# Altium project Panorama_V_0_0_1.PrjPcb
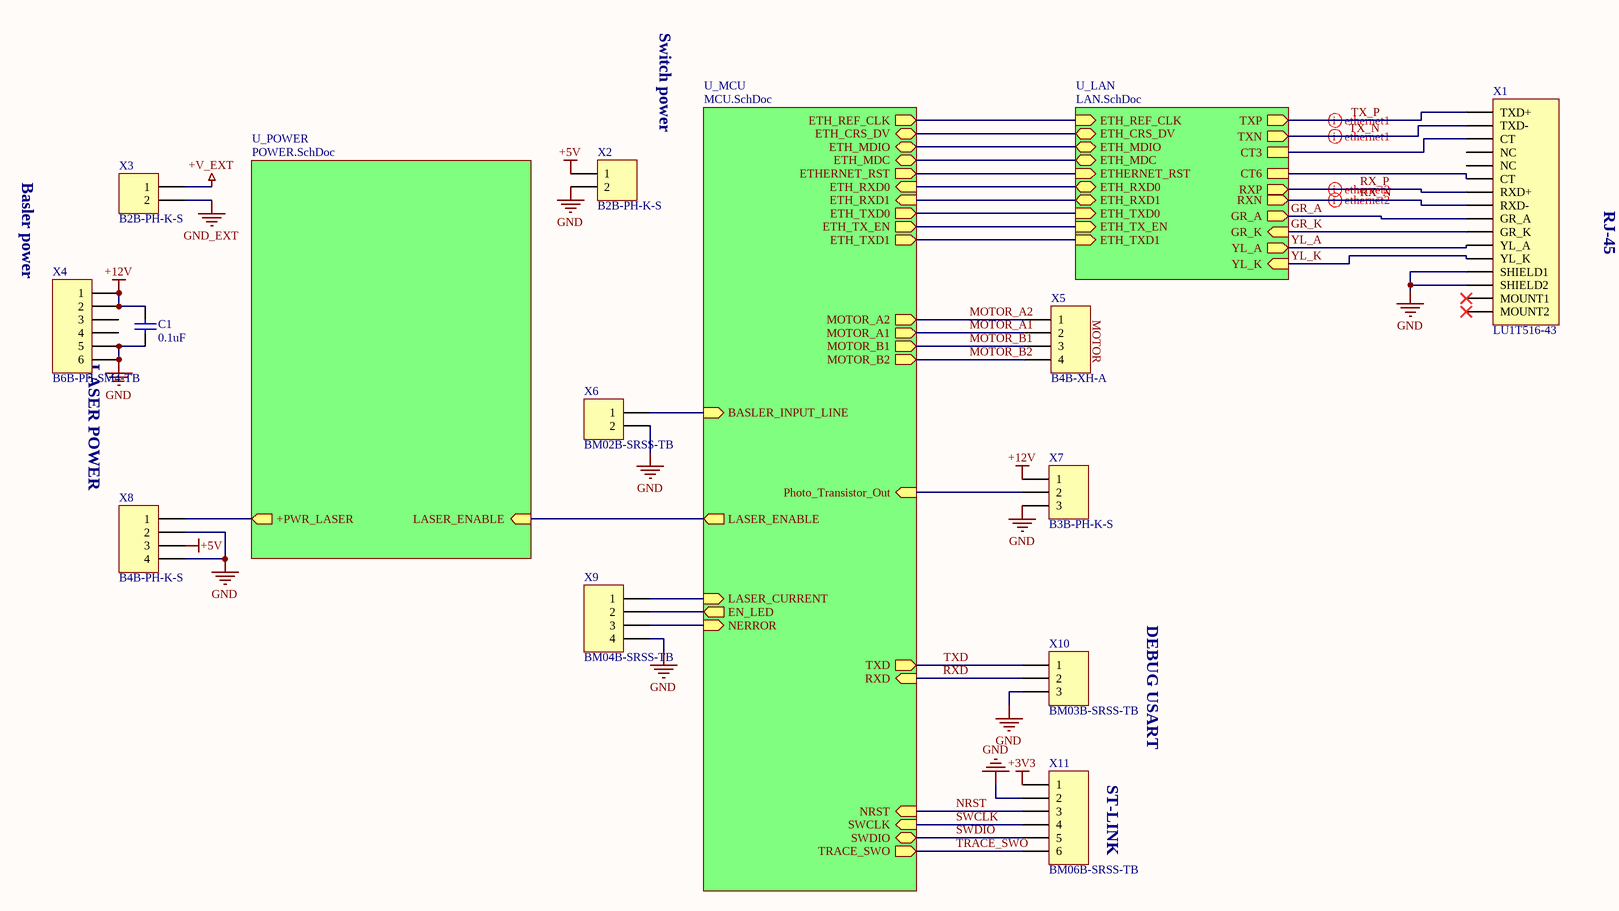
[diagram p0: Panorama_V_0_0_1.SchDoc]
4 sheets, 113 parts. Net scope: hierarchical (ports join the sheet entries above them; power ports are global).
Board file: Panorama_V_0_0_1.PcbDoc
Sheets:
  Panorama_V_0_0_1.SchDoc
    U_POWER = POWER.SchDoc
    U_MCU = MCU.SchDoc
    U_LAN = LAN.SchDoc

## Sheet Panorama_V_0_0_1.SchDoc
size A3

### Parts
C1  value 0.1uF  [C0603]  (hidden comment: C0603-0.1uF-50V-X7R)
X1  LU1T516-43  [LU1T516-43]
X2  B2B-PH-K-S  [B2B-PH-K-S]
X3  B2B-PH-K-S  [B2B-PH-K-S]
X4  B6B-PH-SM4-TB  [B6B-PH-SM4-TB]
X5  B4B-XH-A  [B4B-XH-A]
X6  BM02B-SRSS-TB  [BM02B-SRSS-TB]
X7  B3B-PH-K-S  [B3B-PH-K-S]
X8  B4B-PH-K-S  [B4B-PH-K-S]
X9  BM04B-SRSS-TB  [BM04B-SRSS-TB]
X10  BM03B-SRSS-TB  [BM03B-SRSS-TB]
X11  BM06B-SRSS-TB  [BM06B-SRSS-TB]

### Sub-sheets
U_LAN = LAN.SchDoc: ETH_REF_CLK (in), ETH_CRS_DV (bidir), ETH_MDIO (bidir), ETH_MDC (bidir), ETHERNET_RST (in), ETH_RXD0 (bidir), ETH_RXD1 (bidir), ETH_TXD0 (in), ETH_TX_EN (in), ETH_TXD1 (in), TXP (out), TXN (out), RXP (out), RXN (out), GR_A (out), GR_K (in), YL_A (out), YL_K (in), CT3, CT6
U_MCU = MCU.SchDoc: MOTOR_A2 (out), MOTOR_A1 (out), MOTOR_B1 (out), MOTOR_B2 (out), ETH_REF_CLK (out), ETH_CRS_DV (bidir), ETH_MDIO (bidir), ETH_MDC (bidir), ETHERNET_RST (out), ETH_RXD0 (in), ETH_RXD1 (in), ETH_TXD0 (out), ETH_TX_EN (out), ETH_TXD1 (out), TXD (out), RXD (in), SWCLK (in), TRACE_SWO (out), LASER_ENABLE (out), BASLER_INPUT_LINE (in), LASER_CURRENT (in), EN_LED (out), NERROR (in), SWDIO (bidir), NRST (in), Photo_Transistor_Out (in)
U_POWER = POWER.SchDoc: LASER_ENABLE (in), +PWR_LASER (out)

### Nets
+3V3: X11.1
+3V3_LAN: X1.3(CT) X1.6(CT) ; sheet U_LAN/CT3, sheet U_LAN/CT6
+5V: X2.1 X8.3
+12V: C1.2 X4.1 X4.2 X7.1
+V_EXT: X3.1
GND: C1.1 X1.13(SHIELD1) X1.14(SHIELD2) X2.2 X4.5 X4.6 X6.2 X7.3 X8.2 X8.4 X9.4 X10.3 X11.2
GND_EXT: X3.2
+PWR_LASER: X8.1 ; sheet U_POWER/+PWR_LASER
BASLER_INPUT_LINE: X6.1 ; sheet U_MCU/BASLER_INPUT_LINE
EN_LED: X9.2 ; sheet U_MCU/EN_LED
ETH_CRS_DV: sheet U_MCU/ETH_CRS_DV, sheet U_LAN/ETH_CRS_DV
ETH_MDC: sheet U_MCU/ETH_MDC, sheet U_LAN/ETH_MDC
ETH_MDIO: sheet U_MCU/ETH_MDIO, sheet U_LAN/ETH_MDIO
ETH_REF_CLK: sheet U_MCU/ETH_REF_CLK, sheet U_LAN/ETH_REF_CLK
ETH_RXD0: sheet U_MCU/ETH_RXD0, sheet U_LAN/ETH_RXD0
ETH_RXD1: sheet U_MCU/ETH_RXD1, sheet U_LAN/ETH_RXD1
ETH_TX_EN: sheet U_MCU/ETH_TX_EN, sheet U_LAN/ETH_TX_EN
ETH_TXD0: sheet U_MCU/ETH_TXD0, sheet U_LAN/ETH_TXD0
ETH_TXD1: sheet U_MCU/ETH_TXD1, sheet U_LAN/ETH_TXD1
ETHERNET_RST: sheet U_MCU/ETHERNET_RST, sheet U_LAN/ETHERNET_RST
GR_A: X1.9(GR_A) ; sheet U_LAN/GR_A
GR_K: X1.10(GR_K) ; sheet U_LAN/GR_K
LASER_CURRENT: X9.1 ; sheet U_MCU/LASER_CURRENT
LASER_ENABLE: sheet U_POWER/LASER_ENABLE, sheet U_MCU/LASER_ENABLE
MOTOR_A1: X5.2 ; sheet U_MCU/MOTOR_A1
MOTOR_A2: X5.1 ; sheet U_MCU/MOTOR_A2
MOTOR_B1: X5.3 ; sheet U_MCU/MOTOR_B1
MOTOR_B2: X5.4 ; sheet U_MCU/MOTOR_B2
NERROR: X9.3 ; sheet U_MCU/NERROR
NRST: X11.3 ; sheet U_MCU/NRST
Photo_Transistor_Out: X7.2 ; sheet U_MCU/Photo_Transistor_Out
RX_N: X1.8(RXD-) ; sheet U_LAN/RXN
RX_P: X1.7(RXD+) ; sheet U_LAN/RXP
RXD: X10.2 ; sheet U_MCU/RXD
SWCLK: X11.4 ; sheet U_MCU/SWCLK
SWDIO: X11.5 ; sheet U_MCU/SWDIO
TRACE_SWO: X11.6 ; sheet U_MCU/TRACE_SWO
TX_N: X1.2(TXD-) ; sheet U_LAN/TXN
TX_P: X1.1(TXD+) ; sheet U_LAN/TXP
TXD: X10.1 ; sheet U_MCU/TXD
YL_A: X1.11(YL_A) ; sheet U_LAN/YL_A
YL_K: X1.12(YL_K) ; sheet U_LAN/YL_K

Not connected (* = marked no-connect by the designer): X1 4(NC) 5(NC) 15(MOUNT1)* 16(MOUNT2)*; X4 3 4 7(DNC) 8(DNC); X6 3(DNC) 4(DNC); X9 5 6; X10 4(DNC) 5(DNC); X11 7(DNC) 8(DNC)

### Layout directives
differential pair: RX_N, RX_P, TX_N, TX_P

### Notes on the sheet
- Switch power
- RJ-45
- (near X4) Basler power
- (near X5) MOTOR
- (near X8) LASER POWER
- DEBUG USART
- (near X11) ST-LINK

### Library data of the parts
C1 = C0603-0.1uF-50V-X7R: Ceramic Capacitor; Supplier 1: Digi-Key; Supplier Part Number 1: 445-1324-1-ND
X1 = LU1T516-43: Ethernet RJ-45
X2 X3 = B2B-PH-K-S: Connector, 2mm; Voltage: 100V; Current: 2A; HelpUrl: \\Storage\Volume_2\SPEKTR-AT\Catalogs\Jst\PH.pdf; Supplier 1: Digi-Key; Supplier Part Number 1: 455-1262-ND
X4 = B6B-PH-SM4-TB: Connector, 2mm; Voltage: 100V; Current: 2A; HelpUrl: \\Storage\Volume_2\SPEKTR-AT\Catalogs\Jst\PH.pdf; Supplier 1: Digi-Key; Supplier Part Number 1: 455-1738-1-ND
X5 = B4B-XH-A: Connector, 2.5mm; Voltage: 250V; Current: 3A; HelpUrl: \\Storage\Volume_2\SPEKTR-AT\Catalogs\Jst\eXH.pdf; Supplier 1: Digi-Key; Supplier Part Number 1: 455-2249-ND
X6 = BM02B-SRSS-TB: Connector, 1mm; Voltage: 50V; Current: 0.7A; HelpUrl: \\Storage\Volume_2\SPEKTR-AT\Catalogs\Jst\eSR.pdf; Supplier 1: Digi-Key; Supplier Part Number 1: 455-1406-1-ND
X7 = B3B-PH-K-S: Connector, 2mm; Voltage: 100V; Current: 2A; HelpUrl: \\Storage\Volume_2\SPEKTR-AT\Catalogs\Jst\PH.pdf; Supplier 1: Digi-Key; Supplier Part Number 1: 455-1273-ND
X8 = B4B-PH-K-S: Connector, 2mm; Voltage: 100V; Current: 2A; HelpUrl: \\Storage\Volume_2\SPEKTR-AT\Catalogs\Jst\PH.pdf; Supplier 1: Digi-Key; Supplier Part Number 1: 455-1279-ND
X9 = BM04B-SRSS-TB: Connector, 1mm; Voltage: 50V; Current: 0.7A; HelpUrl: \\Storage\Volume_2\SPEKTR-AT\Catalogs\Jst\eSR.pdf; Supplier 1: Digi-Key; Supplier Part Number 1: 455-1408-1-ND
X10 = BM03B-SRSS-TB: Connector, 1mm; Voltage: 50V; Current: 0.7A; HelpUrl: \\Storage\Volume_2\SPEKTR-AT\Catalogs\Jst\eSR.pdf; Supplier 1: Digi-Key; Supplier Part Number 1: 455-1407-1-ND
X11 = BM06B-SRSS-TB: Connector, 1mm; Voltage: 50V; Current: 0.7A; HelpUrl: \\Storage\Volume_2\SPEKTR-AT\Catalogs\Jst\eSR.pdf; Supplier 1: Digi-Key; Supplier Part Number 1: 455-1410-1-ND

## Sheet POWER.SchDoc
size A3
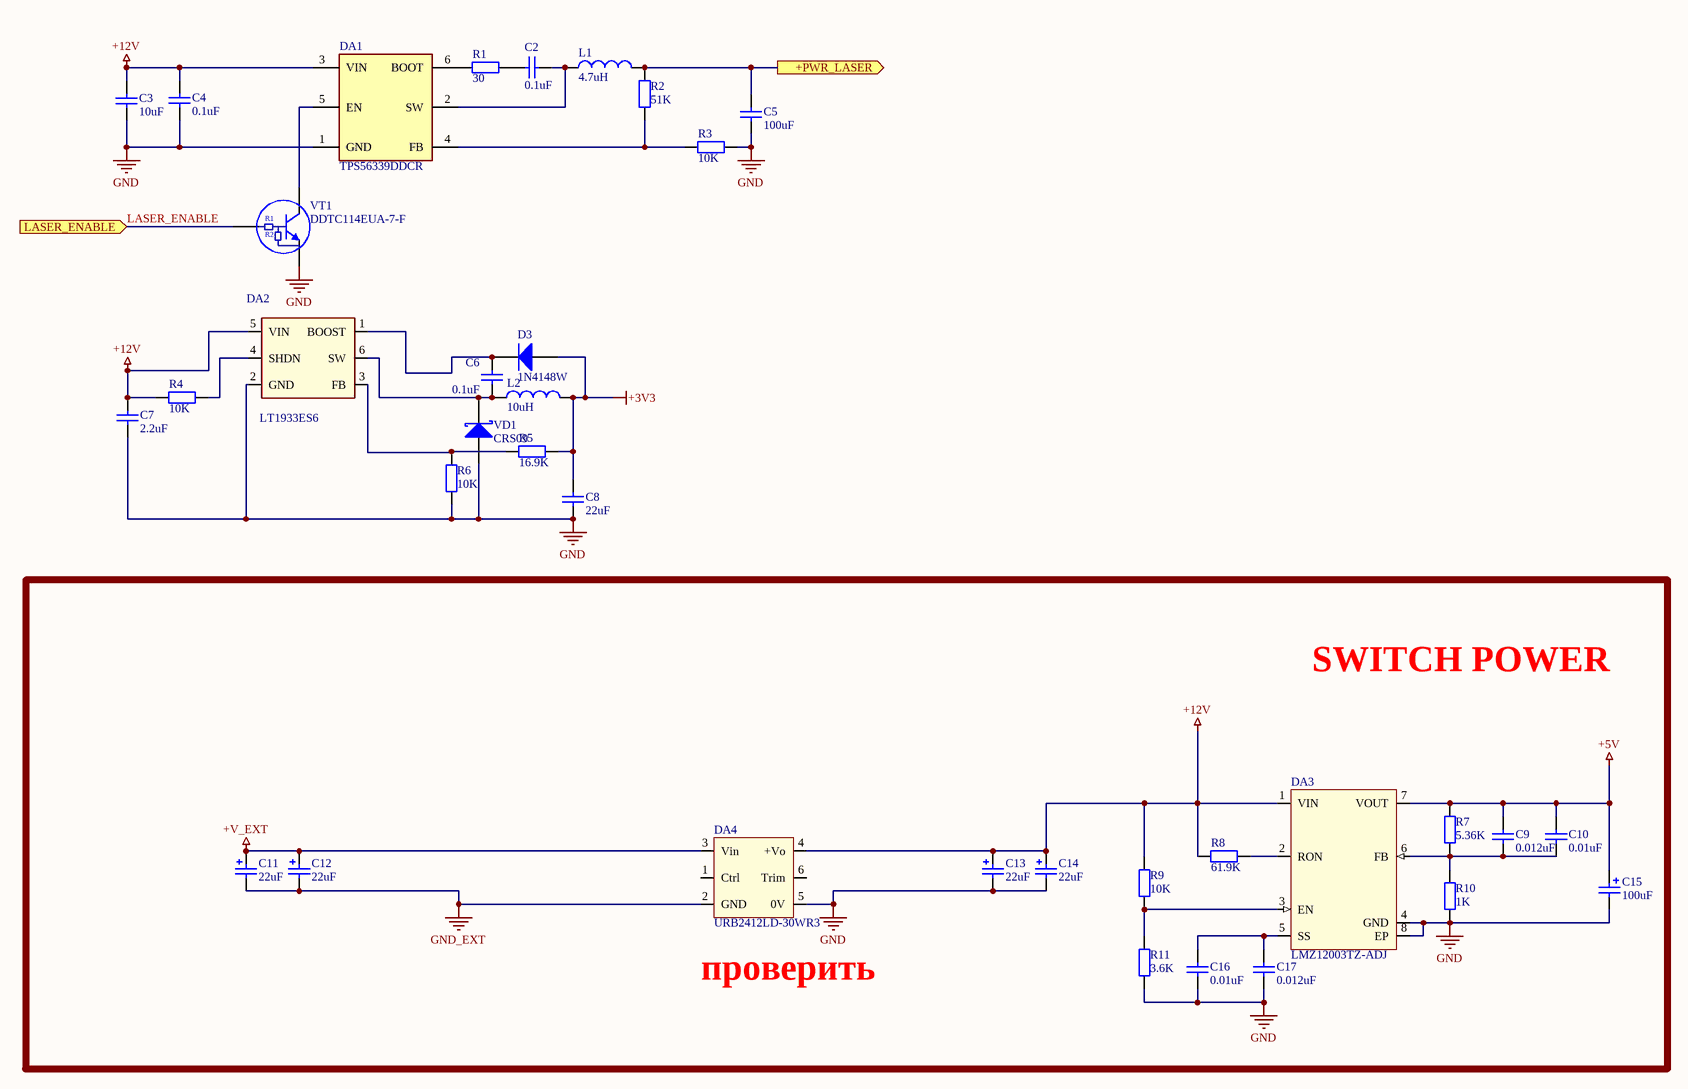
[diagram p1: POWER.SchDoc]

### Parts
C2  value 0.1uF  [C0603]  (hidden comment: C0603-0.1uF-50V-X7R)
C3  value 10uF  [C1210]  (hidden comment: C1210-10uF-50V-X7R)
C4  value 0.1uF  [C0603]  (hidden comment: C0603-0.1uF-50V-X7R)
C5  value 100uF  [C1206]  (hidden comment: C1206-100uF-10V-X5R)
C6  value 0.1uF  [C0603]  (hidden comment: C0603-0.1uF-50V-X7R)
C7  value 2.2uF  [C1206]  (hidden comment: C1206-2.2uF-50V-X7R)
C8  value 22uF  [C0805]  (hidden comment: C0805-22uF-10V-X5R)
C9  value 0.012uF  [C0603]  (hidden comment: C0603-0.012uF-50V-X7R)
C10  value 0.01uF  [C0603]  (hidden comment: C0603-0.01uF-50V-X7R)
C11  value 22uF  [CTD]  (hidden comment: CTD-22uF-35V)
C12  value 22uF  [CTD]  (hidden comment: CTD-22uF-35V)
C13  value 22uF  [CTD]  (hidden comment: CTD-22uF-35V)
C14  value 22uF  [CTD]  (hidden comment: CTD-22uF-35V)
C15  value 100uF  [CTD]  (hidden comment: CTD-100uF-16V)
C16  value 0.01uF  [C0603]  (hidden comment: C0603-0.01uF-50V-X7R)
C17  value 0.012uF  [C0603]  (hidden comment: C0603-0.012uF-50V-X7R)
D3  1N4148W  [SOD323]
DA1  TPS56339DDCR  [SOT23-6]
DA2  LT1933ES6  [SOT23-6]
DA3  LMZ12003TZ-ADJ  [TZA07A]
DA4  URB2412LD-30WR3  [URB2412LD-30WR3]
L1  value 4.7uH  [CDRH8D43]  (hidden comment: CDRH8D43NP-4R7NC)
L2  value 10uH  [VLCF4020T]  (hidden comment: VLCF4020T-100MR85)
R1  value 30  [R0603]  (hidden comment: R0603-30-1%)
R2  value 51K  [R0603]  (hidden comment: R0603-51K-1%)
R3  value 10K  [R0603]  (hidden comment: R0603-10K-1%)
R4  value 10K  [R0603]  (hidden comment: R0603-10K-1%)
R5  value 16.9K  [R0603]  (hidden comment: R0603-16.9K-1%)
R6  value 10K  [R0603]  (hidden comment: R0603-10K-1%)
R7  value 5.36K  [R0603]  (hidden comment: R0603-5.36K-1%)
R8  value 61.9K  [R0603]  (hidden comment: R0603-61.9K-1%)
R9  value 10K  [R0603]  (hidden comment: R0603-10K-1%)
R10  value 1K  [R0603]  (hidden comment: R0603-1K-1%)
R11  value 3.6K  [R0603]  (hidden comment: R0603-3.6K-1%)
VD1  CRS09  [SFLAT]
VT1  DDTC114EUA-7-F  [SOT323]

### Ports
+PWR_LASER (out), LASER_ENABLE (in)

### Nets
+3V3: C8.2 D3.1(A) L2.2 R5.2
+5V: C9.2 C10.2 C15.1 DA3.7(VOUT) R7.2
+12V: C3.2 C4.1 C7.2 C13.1 C14.1 DA1.3(VIN) DA2.5(VIN) DA3.1(VIN) DA4.4(+Vo) R4.2 R8.1 R9.2
+V_EXT: C11.1 C12.1 DA4.3(Vin)
GND: C3.1 C4.2 C5.1 C7.1 C8.1 C13.2 C14.2 C15.2 C16.1 C17.1 DA1.1(GND) DA2.2(GND) DA3.4(GND) DA3.8(EP) DA4.5(0V) R3.1 R6.1 R10.1 R11.1 VD1.1(A) VT1.2(E)
GND_EXT: C11.2 C12.2 DA4.2(GND)
+PWR_LASER: C5.2 L1.2 R2.2 ; port +PWR_LASER
LASER_ENABLE: VT1.1(B) ; port LASER_ENABLE
NetC2_1: C2.1 DA1.2(SW) L1.1
NetC2_2: C2.2 R1.2
NetC6_1: C6.1 DA2.6(SW) L2.1 VD1.2(K)
NetC6_2: C6.2 D3.2(K) DA2.1(BOOST)
NetC9_1: C9.1 C10.1 DA3.6(FB) R7.1 R10.2
NetC16_2: C16.2 C17.2 DA3.5(SS)
NetDA1_4: DA1.4(FB) R2.1 R3.2
NetDA1_5: DA1.5(EN) VT1.3(C)
NetDA1_6: DA1.6(BOOT) R1.1
NetDA2_3: DA2.3(FB) R5.1 R6.2
NetDA2_4: DA2.4(SHDN) R4.1
NetDA3_2: DA3.2(RON) R8.2
NetDA3_3: DA3.3(EN) R9.1 R11.2

Not connected (* = marked no-connect by the designer): DA4 1(Ctrl) 6(Trim)

### Notes on the sheet
- SWITCH POWER
- (near DA4) проверить
- (in symbol DDTC114EUA-7-F) R1; R2

### Library data of the parts
C2 C4 C6 = C0603-0.1uF-50V-X7R: Ceramic Capacitor; Supplier 1: Digi-Key; Supplier Part Number 1: 445-1324-1-ND
C3 = C1210-10uF-50V-X7R: Ceramic Capacitor; Supplier 1: Digi-Key
C5 = C1206-100uF-10V-X5R: Ceramic Capacitor; Supplier 1: Digi-Key; Supplier Part Number 1: 445-6007-1-ND
C7 = C1206-2.2uF-50V-X7R: Ceramic Capacitor; Supplier 1: Digi-Key; Supplier Part Number 1: 1276-2723-2-ND
C8 = C0805-22uF-10V-X5R: Ceramic Capacitor; Supplier 1: Digi-Key; Supplier Part Number 1: 490-10511-1-ND
C9 C17 = C0603-0.012uF-50V-X7R: Ceramic Capacitor; Supplier 1: Digi-Key; Supplier Part Number 1: 490-1513-1-ND
C10 C16 = C0603-0.01uF-50V-X7R: Ceramic Capacitor; Supplier 1: Digi-Key; Supplier 2: Digi-Key; Supplier 3: Digi-Key; Supplier Part Number 1: 445-1311-1-ND; Supplier Part Number 2: 478-1227-1-ND; Supplier Part Number 3: GRM188R61H103KA01D-ND
C11-C14 = CTD-22uF-35V: Tantalum Capacitor; Supplier 1: Digi-Key; Supplier Part Number 1: 478-1730-2-ND
C15 = CTD-100uF-16V: Tantalum Capacitor; Supplier 1: Digi-Key; Supplier Part Number 1: 478-1723-1-ND
D3 = 1N4148W: Diode; Voltage - DC Reverse (Vr) (Max): 75V; Current - Average Rectified (Io): 150mA; Type: DIODE 75V 150MA SOD323F; HelpUrl: \\Storage\Volume_2\SPEKTR-AT\Catalogs\General Semiconductor\Diodes\1N4148W.pdf; Supplier 1: Digi-Key; Supplier Part Number 1: 1N4148WSFSCT-ND
DA1 = TPS56339DDCR: 4.5-V to 24-V Input, 3-A Output Synchronous Buck Converter
DA2 = LT1933ES6: PWM step-down DC/DC / converter; Supplier 1: Digi-Key; Help URL: https://www.analog.com/media/en/technical-documentation/data-sheets/1933fe.pdf; Supplier Part Number 1: LT1933ES6#TRPBFCT-ND
DA4 = URB2412LD-30WR3: DC/DC Converter; HelpUrl: https://www.mornsun-power.com/uploads/pdf/URA_LD-30WR3.pdf
L1 = CDRH8D43NP-4R7NC: Inductor; Current: 4.1A; HelpUrl: http://products.sumida.com/products/pdf/CDRH8D43.pdf?__cf_chl_captcha_tk__=f2dd78b9027a2fe299a3aea71ee132a4cfb9459e-1615548098-0-AWv3dTlkYHb3pOZx47LrfRgQQvnbYyh137kl7uefua50nLxSKUUGrqtlCCjrc1LswX_-r6oJbyvsXa0yR2eZdE77H7aOBf-QBKkOOMSNJ3pig1erzpUNp_TWXk-67akAQoTQvkftj8OlbHqQ4H9RdFe8fQ1CNp0rbmLJm5OjBfnKhuu7dCwp-XrQqmHs-aSAf8GurMArTLM56usz57RsDvF83AfaOxVDPdkr-RR6vFv2ejXMzOBUncU1xYUxw2-FtoS50eUSjk3uK32pDW9RQcB7at0zBTfYb7z1XEUU3cNH-LJQFJ6S0r5aCxNOxKsPMag80AtDB68AL3MlL4250ERsFMEv8i6qyXeCYUzPNYhi5Kb7tXKzIjKI_FhX1Ng3Qx8LpjLxEYYXtRJxk8ucr1dLSxq3fgiNj3w-8N0UD2uklKGxzL9lR3tVA2FN_GumzljjVLssxYWb0rvnE7uglc0dEdjxHXEVFs1mSRKMElWKfz_-O5_flhZzggBpUNnWAvtXJkCTCVIunYUQ6UPsGfkNtnBhdXmaIx3qARKHbMCtbeIkj50XdSCf7pF1-MSMB-QwGxhNOsgDZ-CJKYC0bho; Supplier 1: DigiKey; Supplier Part Number 1: 308-2317-2-ND
L2 = VLCF4020T-100MR85: Inductor; Current: 0.85A; HelpUrl: \\Storage\Volume_2\SPEKTR-AT\Catalogs\Tdk\Inductors\vlcf4020.pdf; Supplier 1: Digi-Key; Supplier Part Number 1: 445-3186-1-ND
R1 = R0603-30-1%: Chip Resistor; Supplier 1: Digi-Key; Supplier Part Number 1: P30.0HCT-ND
R2 = R0603-51K-1%: Chip Resistor; Supplier 1: Digi-Key; Supplier Part Number 1: P51.0KHCT-ND
R3 R4 R6 R9 = R0603-10K-1%: Chip Resistor; Supplier 1: Digi-Key; Supplier Part Number 1: P10.0KHCT-ND
R5 = R0603-16.9K-1%: Chip Resistor; Supplier 1: Digi-Key; Supplier Part Number 1: P16.9KHCT-ND
R7 = R0603-5.36K-1%: Chip Resistor; Supplier 1: Digi-Key; Supplier Part Number 1: P5.36KHCT-ND
R8 = R0603-61.9K-1%: Chip Resistor; Supplier 1: Digi-Key; Supplier Part Number 1: P61.9KHCT-ND
R10 = R0603-1K-1%: Chip Resistor; Supplier 1: Digi-Key; Supplier Part Number 1: P1.00KHCT-ND
R11 = R0603-3.6K-1%: Chip Resistor; Supplier 1: Digi-Key; Supplier Part Number 1: P3.60KHCT-ND
VD1 = CRS09(TE85L,Q,M): Diode Schottky; Supplier 1: Digi-Key; Supplier Part Number 1: CRS09QCT-ND
VT1 = DDTC114EUA-7-F: NPN; Vin: -10...40 V; Iout: 50...100 mA; Vout: 0.1V; Type: TRANS PREBIAS NPN 200MW SC70-3; HelpUrl: \\storage\volume_2\SPEKTR-AT\Catalogs\Rohm\Transistors\DTC114EE.pdf; Supplier 1: Digi-Key; Supplier Part Number 1: DDTC114EUA-FDICT-ND
DA3 = LMZ12003TZ-ADJ: Type: 1A SIMPLE SWITCHER® Power Module with 20V Maximum  Input Voltage; HelpUrl: *

## Sheet MCU.SchDoc
size A2
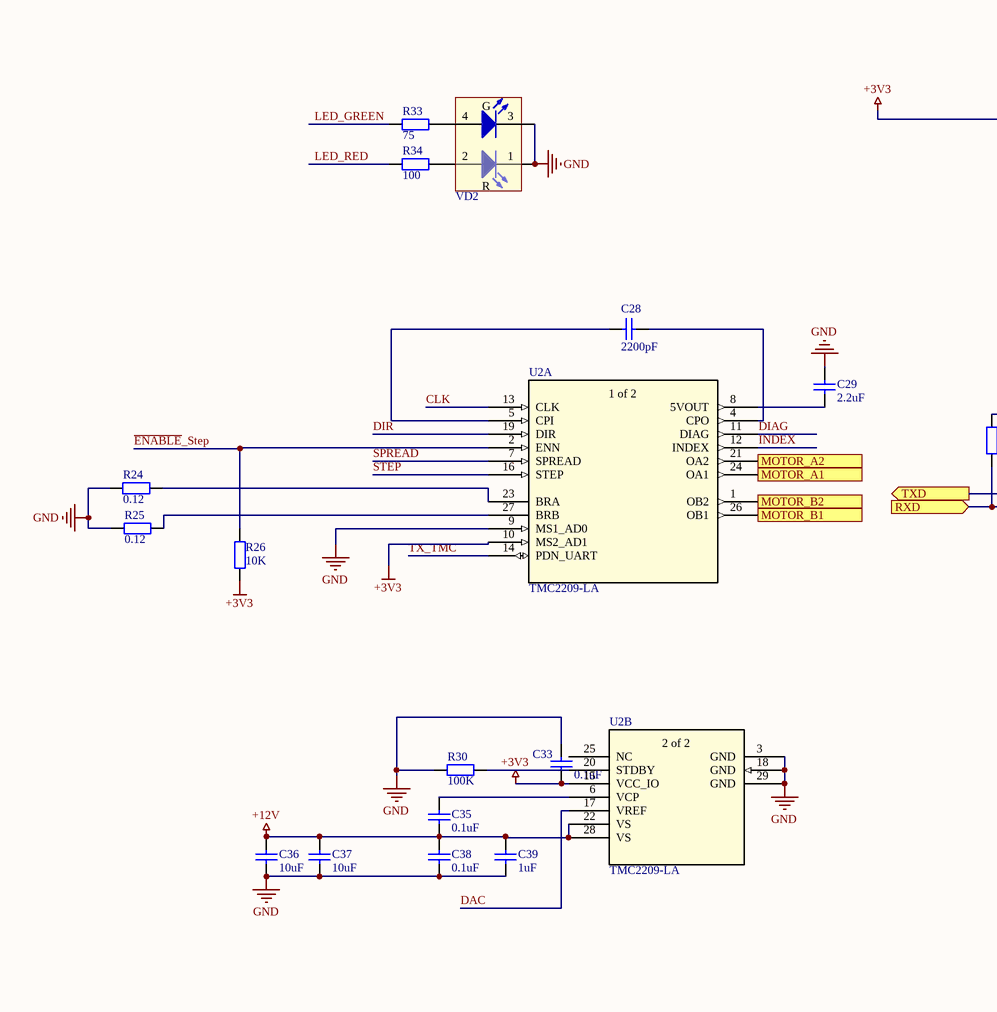
[diagram p2: MCU.SchDoc, left]
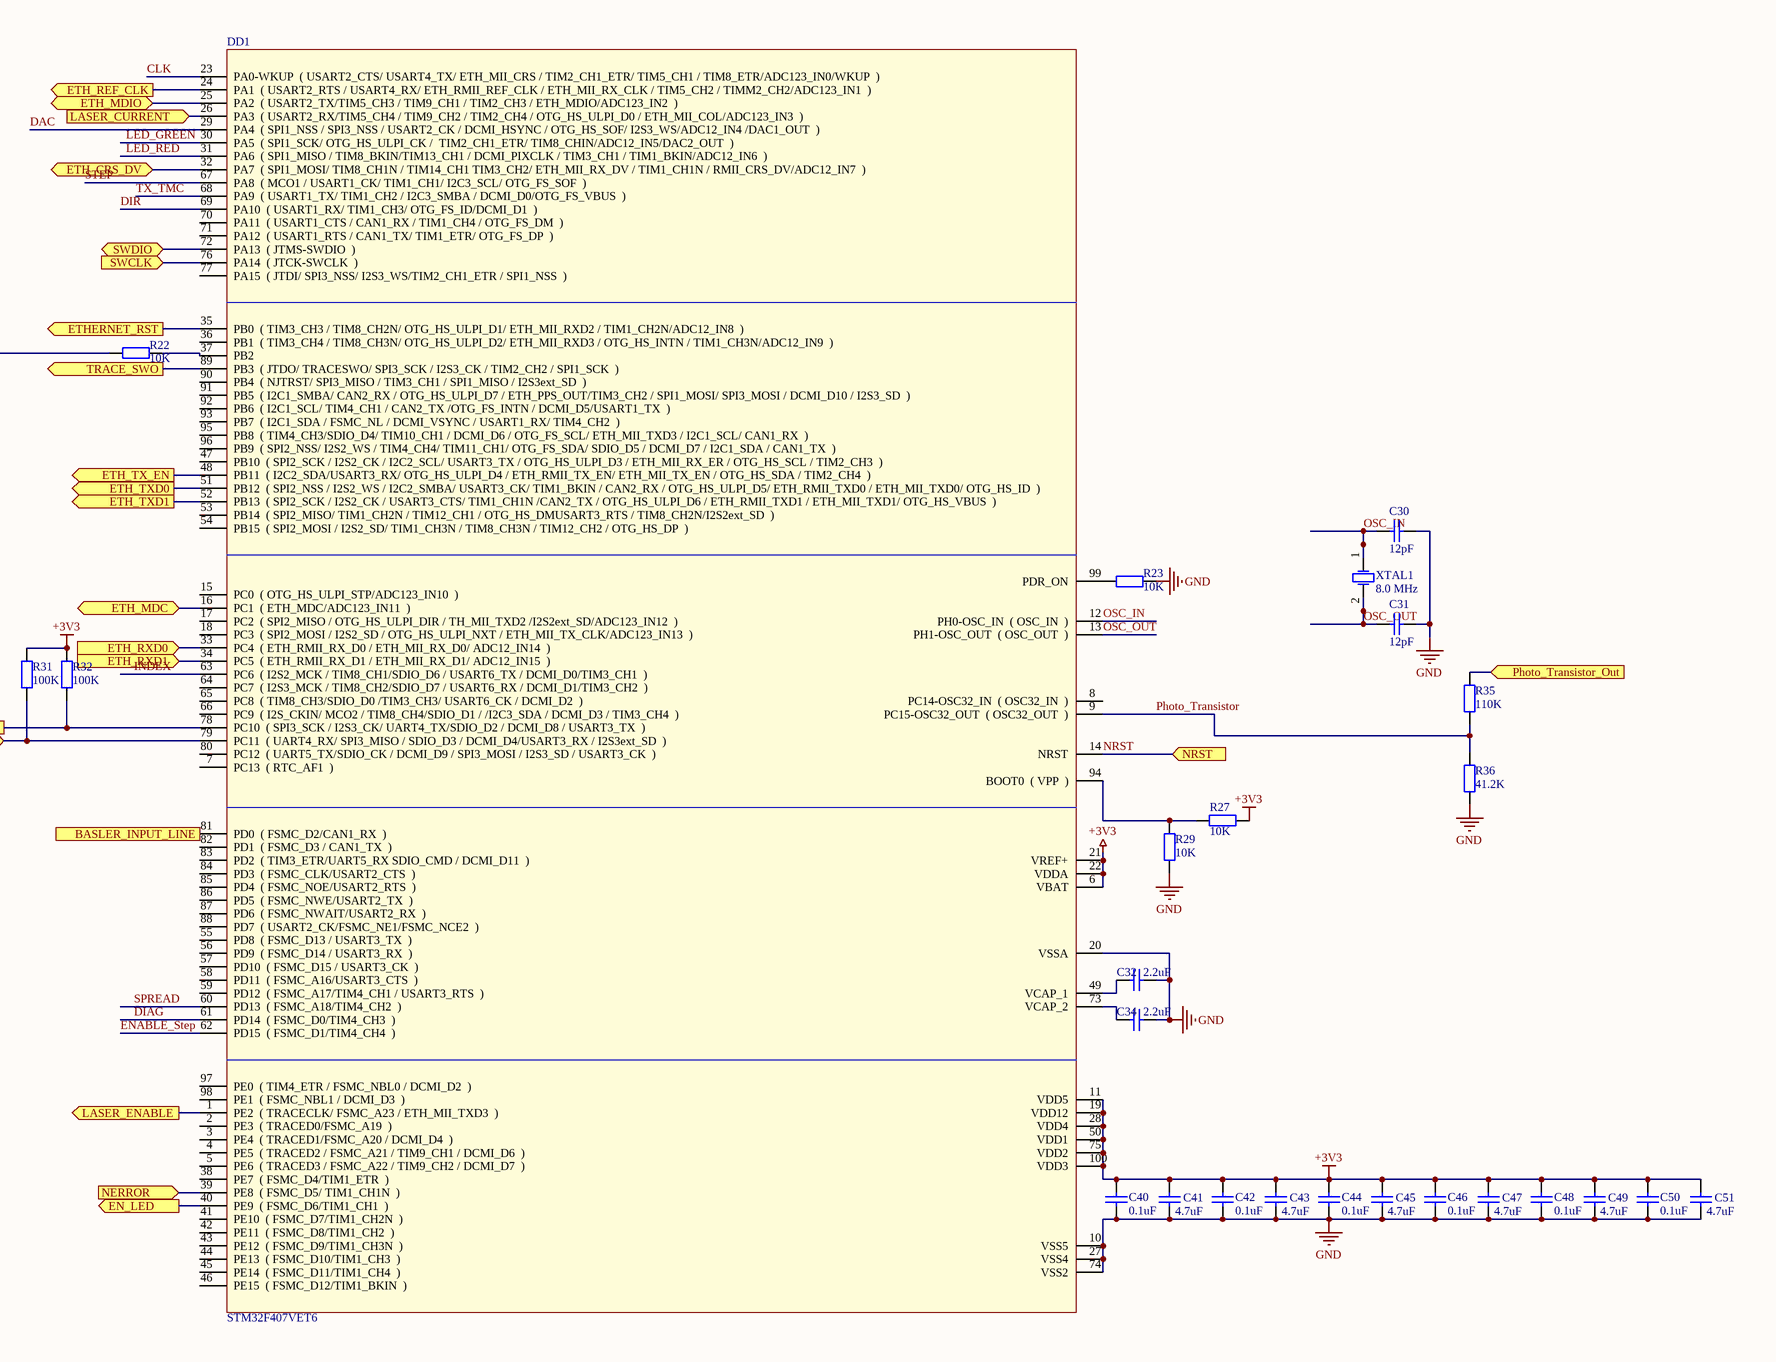
[diagram p3: MCU.SchDoc, right]

### Parts
C28  value 2200pF  [C0603]  (hidden comment: C0603-2200pF-50V-X7R)
C29  value 2.2uF  [C1206]  (hidden comment: C1206-2.2uF-25V-X5R)
C30  value 12pF  [C0603]  (hidden comment: C0603-12pF-50V-NP0)
C31  value 12pF  [C0603]  (hidden comment: C0603-12pF-50V-NP0)
C32  value 2.2uF  [C0805]  (hidden comment: C0805-2.2uF-16V-Y5V)
C33  value 0.1uF  [C0603]  (hidden comment: C0603-0.1uF-50V-X7R)
C34  value 2.2uF  [C0805]  (hidden comment: C0805-2.2uF-16V-Y5V)
C35  value 0.1uF  [C0603]  (hidden comment: C0603-0.1uF-50V-X7R)
C36  value 10uF  [C1210]  (hidden comment: C1210-10uF-50V-X7R)
C37  value 10uF  [C1210]  (hidden comment: C1210-10uF-50V-X7R)
C38  value 0.1uF  [C0603]  (hidden comment: C0603-0.1uF-50V-X7R)
C39  value 1uF  [C0603]  (hidden comment: C0603-1uF-50V-X5R)
C40  value 0.1uF  [C0603]  (hidden comment: C0603-0.1uF-50V-X7R)
C41  value 4.7uF  [C0603]  (hidden comment: C0603-4.7uF-16V-X5R)
C42  value 0.1uF  [C0603]  (hidden comment: C0603-0.1uF-50V-X7R)
C43  value 4.7uF  [C0603]  (hidden comment: C0603-4.7uF-16V-X5R)
C44  value 0.1uF  [C0603]  (hidden comment: C0603-0.1uF-50V-X7R)
C45  value 4.7uF  [C0603]  (hidden comment: C0603-4.7uF-16V-X5R)
C46  value 0.1uF  [C0603]  (hidden comment: C0603-0.1uF-50V-X7R)
C47  value 4.7uF  [C0603]  (hidden comment: C0603-4.7uF-16V-X5R)
C48  value 0.1uF  [C0603]  (hidden comment: C0603-0.1uF-50V-X7R)
C49  value 4.7uF  [C0603]  (hidden comment: C0603-4.7uF-16V-X5R)
C50  value 0.1uF  [C0603]  (hidden comment: C0603-0.1uF-50V-X7R)
C51  value 4.7uF  [C0603]  (hidden comment: C0603-4.7uF-16V-X5R)
DD1  STM32F407VET6  [LQFP100]
R22  value 10K  [R0603]  (hidden comment: R0603-10K-1%)
R23  value 10K  [R0603]  (hidden comment: R0603-10K-1%)
R24  value 0.12  [R1210]  (hidden comment: R1210-0.12-1%)
R25  value 0.12  [R1210]  (hidden comment: R1210-0.12-1%)
R26  value 10K  [R0603]  (hidden comment: R0603-10K-1%)
R27  value 10K  [R0603]  (hidden comment: R0603-10K-1%)
R29  value 10K  [R0603]  (hidden comment: R0603-10K-1%)
R30  value 100K  [R0603]  (hidden comment: R0603-100K-1%)
R31  value 100K  [R0603]  (hidden comment: R0603-100K-1%)
R32  value 100K  [R0603]  (hidden comment: R0603-100K-1%)
R33  value 75  [R0603]  (hidden comment: R0603-75-1%)
R34  value 100  [R0603]  (hidden comment: R0603-100-1%)
R35  value 110K  [R0603]  (hidden comment: R0603-110K-1%)
R36  value 41.2K  [R0603]  (hidden comment: R0603-41.2K-1%)
U2  TMC2209-LA  [QFN28]  (parts A,B of 2)
VD2  KAA-3528ESGC  [KAA-3528]  (value not drawn)
XTAL1  value 8.0 MHz  [ABM3]  (hidden comment: ABM3-8.000MHZ-D2Y-T)

### Ports
BASLER_INPUT_LINE (in), EN_LED (out), ETH_CRS_DV (bidir), ETH_MDC (bidir), ETH_MDIO (bidir), ETH_REF_CLK (out), ETH_RXD0 (in), ETH_RXD1 (in), ETH_TX_EN (out), ETH_TXD0 (out), ETH_TXD1 (out), ETHERNET_RST (out), LASER_CURRENT (in), LASER_ENABLE (out), MOTOR_A1 (out), MOTOR_A2 (out), MOTOR_B1 (out), MOTOR_B2 (out), NERROR (in), NRST (in), Photo_Transistor_Out (in), RXD (in), SWCLK (in), SWDIO (bidir), TRACE_SWO (out), TXD (out)

### Nets
+3V3: C33.1 C40.2 C41.2 C42.2 C43.2 C44.2 C45.2 C46.2 C47.2 C48.2 C49.2 C50.2 C51.2 DD1.6(VBAT) DD1.11(VDD5) DD1.19(VDD12) DD1.21(VREF+) DD1.22(VDDA) DD1.28(VDD4) DD1.50(VDD1) DD1.75(VDD2) DD1.100(VDD3) R22.1 R26.2 R27.2 R31.1 R32.1 U2.10(MS2_AD1) U2.15(VCC_IO)
+12V: C35.1 C36.2 C37.2 C38.2 C39.2 U2.22(VS) U2.28(VS)
GND: C29.1 C30.1 C31.1 C32.1 C33.2 C34.1 C36.1 C37.1 C38.1 C39.1 C40.1 C41.1 C42.1 C43.1 C44.1 C45.1 C46.1 C47.1 C48.1 C49.1 C50.1 C51.1 DD1.10(VSS5) DD1.20(VSSA) DD1.27(VSS4) DD1.74(VSS2) R23.2 R24.1 R25.1 R29.2 R30.1 R36.1 U2.3(GND) U2.9(MS1_AD0) U2.18(GND) U2.29(GND) VD2.1(K2) VD2.3(K1)
BASLER_INPUT_LINE: DD1.81(PD0__(_FSMC_D2/CAN1_RX__)) ; port BASLER_INPUT_LINE
CLK: DD1.23(PA0-WKUP__(_USART2_CTS/_USART4_TX/_ETH_MII_CRS_/_TIM2_CH1_ETR/_TIM5_CH1_/_TIM8_ETR/ADC123_IN0/WKUP__)) U2.13(CLK)
DAC: DD1.29(PA4__(_SPI1_NSS_/_SPI3_NSS_/_USART2_CK_/_DCMI_HSYNC_/_OTG_HS_SOF/_I2S3_WS/ADC12_IN4_/DAC1_OUT__)) U2.17(VREF)
DIAG: DD1.61(PD14__(_FSMC_D0/TIM4_CH3__)) U2.11(DIAG)
DIR: DD1.69(PA10__(_USART1_RX/_TIM1_CH3/_OTG_FS_ID/DCMI_D1__)) U2.19(DIR)
~{ENABLE}_Step: DD1.62(PD15__(_FSMC_D1/TIM4_CH4__)) R26.1 U2.2(ENN)
EN_LED: DD1.40(PE9__(_FSMC_D6/TIM1_CH1__)) ; port EN_LED
ETH_CRS_DV: DD1.32(PA7__(_SPI1_MOSI/_TIM8_CH1N_/_TIM14_CH1_TIM3_CH2/_ETH_MII_RX_DV_/_TIM1_CH1N_/_RMII_CRS_DV/ADC12_IN7__)) ; port ETH_CRS_DV
ETH_MDC: DD1.16(PC1__(_ETH_MDC/ADC123_IN11__)) ; port ETH_MDC
ETH_MDIO: DD1.25(PA2__(_USART2_TX/TIM5_CH3_/_TIM9_CH1_/_TIM2_CH3_/_ETH_MDIO/ADC123_IN2__)) ; port ETH_MDIO
ETH_REF_CLK: DD1.24(PA1__(_USART2_RTS_/_USART4_RX/_ETH_RMII_REF_CLK_/_ETH_MII_RX_CLK_/_TIM5_CH2_/_TIMM2_CH2/ADC123_IN1__)) ; port ETH_REF_CLK
ETH_RXD0: DD1.33(PC4__(_ETH_RMII_RX_D0_/_ETH_MII_RX_D0/_ADC12_IN14__)) ; port ETH_RXD0
ETH_RXD1: DD1.34(PC5__(_ETH_RMII_RX_D1_/_ETH_MII_RX_D1/_ADC12_IN15__)) ; port ETH_RXD1
ETH_TX_EN: DD1.48(PB11__(_I2C2_SDA/USART3_RX/_OTG_HS_ULPI_D4_/_ETH_RMII_TX_EN/_ETH_MII_TX_EN_/_OTG_HS_SDA_/_TIM2_CH4__)) ; port ETH_TX_EN
ETH_TXD0: DD1.51(PB12__(_SPI2_NSS_/_I2S2_WS_/_I2C2_SMBA/_USART3_CK/_TIM1_BKIN_/_CAN2_RX_/_OTG_HS_ULPI_D5/_ETH_RMII_TXD0_/_ETH_MII_TXD0/_OTG_HS_ID__)) ; port ETH_TXD0
ETH_TXD1: DD1.52(PB13__(_SPI2_SCK_/_I2S2_CK_/_USART3_CTS/_TIM1_CH1N_/CAN2_TX_/_OTG_HS_ULPI_D6_/_ETH_RMII_TXD1_/_ETH_MII_TXD1/_OTG_HS_VBUS__)) ; port ETH_TXD1
ETHERNET_RST: DD1.35(PB0__(_TIM3_CH3_/_TIM8_CH2N/_OTG_HS_ULPI_D1/_ETH_MII_RXD2_/_TIM1_CH2N/ADC12_IN8__)) ; port ETHERNET_RST
INDEX: DD1.63(PC6__(_I2S2_MCK_/_TIM8_CH1/SDIO_D6_/_USART6_TX_/_DCMI_D0/TIM3_CH1__)) U2.12(INDEX)
LASER_CURRENT: DD1.26(PA3__(_USART2_RX/TIM5_CH4_/_TIM9_CH2_/_TIM2_CH4_/_OTG_HS_ULPI_D0_/_ETH_MII_COL/ADC123_IN3__)) ; port LASER_CURRENT
LASER_ENABLE: DD1.1(PE2__(_TRACECLK/_FSMC_A23_/_ETH_MII_TXD3__)) ; port LASER_ENABLE
LED_GREEN: DD1.30(PA5__(_SPI1_SCK/_OTG_HS_ULPI_CK_/__TIM2_CH1_ETR/_TIM8_CHIN/ADC12_IN5/DAC2_OUT__)) R33.1
LED_RED: DD1.31(PA6__(_SPI1_MISO_/_TIM8_BKIN/TIM13_CH1_/_DCMI_PIXCLK_/_TIM3_CH1_/_TIM1_BKIN/ADC12_IN6__)) R34.1
MOTOR_A1: U2.24(OA1) ; port MOTOR_A1
MOTOR_A2: U2.21(OA2) ; port MOTOR_A2
MOTOR_B1: U2.26(OB1) ; port MOTOR_B1
MOTOR_B2: U2.1(OB2) ; port MOTOR_B2
NERROR: DD1.39(PE8__(_FSMC_D5/_TIM1_CH1N__)) ; port NERROR
NRST: DD1.14(NRST) ; port NRST
OSC_IN: C30.2 DD1.12(PH0-OSC_IN__(_OSC_IN__)) XTAL1.1(OSC1)
OSC_OUT: C31.2 DD1.13(PH1-OSC_OUT__(_OSC_OUT__)) XTAL1.2(OSC2)
Photo_Transistor: DD1.9(PC15-OSC32_OUT__(_OSC32_OUT__)) R35.1 R36.2
Photo_Transistor_Out: R35.2 ; port Photo_Transistor_Out
RXD: DD1.79(PC11__(_UART4_RX/_SPI3_MISO_/_SDIO_D3_/_DCMI_D4/USART3_RX_/_I2S3ext_SD__)) R31.2 ; port RXD
SPREAD: DD1.60(PD13__(_FSMC_A18/TIM4_CH2__)) U2.7(SPREAD)
STEP: DD1.67(PA8__(_MCO1_/_USART1_CK/_TIM1_CH1/_I2C3_SCL/_OTG_FS_SOF__)) U2.16(STEP)
SWCLK: DD1.76(PA14__(_JTCK-SWCLK__)) ; port SWCLK
SWDIO: DD1.72(PA13__(_JTMS-SWDIO__)) ; port SWDIO
TRACE_SWO: DD1.89(PB3__(_JTDO/_TRACESWO/_SPI3_SCK_/_I2S3_CK_/_TIM2_CH2_/_SPI1_SCK__)) ; port TRACE_SWO
TX_TMC: DD1.68(PA9__(_USART1_TX/_TIM1_CH2_/_I2C3_SMBA_/_DCMI_D0/OTG_FS_VBUS__)) U2.14(PDN_UART)
TXD: DD1.78(PC10__(_SPI3_SCK_/_I2S3_CK/_UART4_TX/SDIO_D2_/_DCMI_D8_/_USART3_TX__)) R32.2 ; port TXD
NetC28_1: C28.1 U2.5(CPI)
NetC28_2: C28.2 U2.4(CPO)
NetC29_2: C29.2 U2.8(5VOUT)
NetC32_2: C32.2 DD1.49(VCAP_1)
NetC34_2: C34.2 DD1.73(VCAP_2)
NetC35_2: C35.2 U2.6(VCP)
NetDD1_37: DD1.37(PB2) R22.2
NetDD1_94: DD1.94(BOOT0__(_VPP__)) R27.1 R29.1
NetDD1_99: DD1.99(PDR_ON) R23.1
NetR24_2: R24.2 U2.23(BRA)
NetR25_2: R25.2 U2.27(BRB)
NetR30_2: R30.2 U2.20(STDBY)
NetR33_2: R33.2 VD2.4(A1)
NetR34_2: R34.2 VD2.2(A2)

Not connected (* = marked no-connect by the designer): DD1 2(PE3__(_TRACED0/FSMC_A19__)) 3(PE4__(_TRACED1/FSMC_A20_/_DCMI_D4__)) 4(PE5__(_TRACED2_/_FSMC_A21_/_TIM9_CH1_/_DCMI_D6__)) 5(PE6__(_TRACED3_/_FSMC_A22_/_TIM9_CH2_/_DCMI_D7__)) 7(PC13__(_RTC_AF1__)) 8(PC14-OSC32_IN__(_OSC32_IN__)) 15(PC0__(_OTG_HS_ULPI_STP/ADC123_IN10__)) 17(PC2__(_SPI2_MISO_/_OTG_HS_ULPI_DIR_/_TH_MII_TXD2_/I2S2ext_SD/ADC123_IN12__)) 18(PC3__(_SPI2_MOSI_/_I2S2_SD_/_OTG_HS_ULPI_NXT_/_ETH_MII_TX_CLK/ADC123_IN13__)) 36(PB1__(_TIM3_CH4_/_TIM8_CH3N/_OTG_HS_ULPI_D2/_ETH_MII_RXD3_/_OTG_HS_INTN_/_TIM1_CH3N/ADC12_IN9__)) 38(PE7__(_FSMC_D4/TIM1_ETR__)) 41(PE10__(_FSMC_D7/TIM1_CH2N__)) 42(PE11__(_FSMC_D8/TIM1_CH2__)) 43(PE12__(_FSMC_D9/TIM1_CH3N__)) 44(PE13__(_FSMC_D10/TIM1_CH3__)) 45(PE14__(_FSMC_D11/TIM1_CH4__)) 46(PE15__(_FSMC_D12/TIM1_BKIN__)) 47(PB10__(_SPI2_SCK_/_I2S2_CK_/_I2C2_SCL/_USART3_TX_/_OTG_HS_ULPI_D3_/_ETH_MII_RX_ER_/_OTG_HS_SCL_/_TIM2_CH3__)) 53(PB14__(_SPI2_MISO/_TIM1_CH2N_/_TIM12_CH1_/_OTG_HS_DMUSART3_RTS_/_TIM8_CH2N/I2S2ext_SD__)) 54(PB15__(_SPI2_MOSI_/_I2S2_SD/_TIM1_CH3N_/_TIM8_CH3N_/_TIM12_CH2_/_OTG_HS_DP__)) 55(PD8__(_FSMC_D13_/_USART3_TX__)) 56(PD9__(_FSMC_D14_/_USART3_RX__)) 57(PD10__(_FSMC_D15_/_USART3_CK__)) 58(PD11__(_FSMC_A16/USART3_CTS__)) 59(PD12__(_FSMC_A17/TIM4_CH1_/_USART3_RTS__)) 64(PC7__(_I2S3_MCK_/_TIM8_CH2/SDIO_D7_/_USART6_RX_/_DCMI_D1/TIM3_CH2__)) 65(PC8__(_TIM8_CH3/SDIO_D0_/TIM3_CH3/_USART6_CK_/_DCMI_D2__)) 66(PC9__(_I2S_CKIN/_MCO2_/_TIM8_CH4/SDIO_D1_/_/I2C3_SDA_/_DCMI_D3_/_TIM3_CH4__)) 70(PA11__(_USART1_CTS_/_CAN1_RX_/_TIM1_CH4_/_OTG_FS_DM__)) 71(PA12__(_USART1_RTS_/_CAN1_TX/_TIM1_ETR/_OTG_FS_DP__)) 77(PA15__(_JTDI/_SPI3_NSS/_I2S3_WS/TIM2_CH1_ETR_/_SPI1_NSS__)) 80(PC12__(_UART5_TX/SDIO_CK_/_DCMI_D9_/_SPI3_MOSI_/_I2S3_SD_/_USART3_CK__)) 82(PD1__(_FSMC_D3_/_CAN1_TX__)) 83(PD2__(_TIM3_ETR/UART5_RX_SDIO_CMD_/_DCMI_D11__)) 84(PD3__(_FSMC_CLK/USART2_CTS__)) 85(PD4__(_FSMC_NOE/USART2_RTS__)) 86(PD5__(_FSMC_NWE/USART2_TX__)) 87(PD6__(_FSMC_NWAIT/USART2_RX__)) 88(PD7__(_USART2_CK/FSMC_NE1/FSMC_NCE2__)) 90(PB4__(_NJTRST/_SPI3_MISO_/_TIM3_CH1_/_SPI1_MISO_/_I2S3ext_SD__)) 91(PB5__(_I2C1_SMBA/_CAN2_RX_/_OTG_HS_ULPI_D7_/_ETH_PPS_OUT/TIM3_CH2_/_SPI1_MOSI/_SPI3_MOSI_/_DCMI_D10_/_I2S3_SD__)) 92(PB6__(_I2C1_SCL/_TIM4_CH1_/_CAN2_TX_/OTG_FS_INTN_/_DCMI_D5/USART1_TX__)) 93(PB7__(_I2C1_SDA_/_FSMC_NL_/_DCMI_VSYNC_/_USART1_RX/_TIM4_CH2__)) 95(PB8__(_TIM4_CH3/SDIO_D4/_TIM10_CH1_/_DCMI_D6_/_OTG_FS_SCL/_ETH_MII_TXD3_/_I2C1_SCL/_CAN1_RX__)) 96(PB9__(_SPI2_NSS/_I2S2_WS_/_TIM4_CH4/_TIM11_CH1/_OTG_FS_SDA/_SDIO_D5_/_DCMI_D7_/_I2C1_SDA_/_CAN1_TX__)) 97(PE0__(_TIM4_ETR_/_FSMC_NBL0_/_DCMI_D2__)) 98(PE1__(_FSMC_NBL1_/_DCMI_D3__)); U2 25(NC)

### Notes on the sheet
- (in symbol KAA-3528ESGC) G; R
- (in symbol TMC2209-LA, part A) 1 of 2
- (in symbol TMC2209-LA, part B) 2 of 2

### Library data of the parts
C28 = C0603-2200pF-50V-X7R: Ceramic Capacitor; Supplier 1: Digi-Key; Supplier Part Number 1: 445-1309-1-ND
C29 = C1206-2.2uF-25V-X5R: Ceramic Capacitor; Supplier 1: Digi-Key; Supplier Part Number 1: 445-4045-1-ND
C30 C31 = C0603-12pF-50V-NP0: Ceramic Capacitor; Supplier 1: Digi-Key; Supplier Part Number 1: 445-1270-1-ND
C32 C34 = C0805-2.2uF-16V-Y5V: Ceramic Capacitor; Supplier 1: Digi-Key; Supplier Part Number 1: 445-3464-1-ND
C33 C35 C38 C40 C42 C44 C46 C48 C50 = C0603-0.1uF-50V-X7R: Ceramic Capacitor; Supplier 1: Digi-Key; Supplier Part Number 1: 445-1324-1-ND
C36 C37 = C1210-10uF-50V-X7R: Ceramic Capacitor; Supplier 1: Digi-Key
C39 = C0603-1uF-50V-X5R: Ceramic Capacitor; Supplier 1: Digi-Key; Supplier Part Number 1: PCC2174TR-ND
C41 C43 C45 C47 C49 C51 = C0603-4.7uF-16V-X5R: Ceramic Capacitor; Supplier 1: Digi-Key; Supplier Part Number 1: 445-7478-1-ND
R22 R23 R26 R27 R29 = R0603-10K-1%: Chip Resistor; Supplier 1: Digi-Key; Supplier Part Number 1: P10.0KHCT-ND
R24 R25 = R1210-0.12-1%: Chip Resistor; Supplier 1: Digi-Key; Supplier Part Number 1: 311-0.12NATR-ND
R30-R32 = R0603-100K-1%: Chip Resistor; Supplier 1: Digi-Key; Supplier Part Number 1: P100KHCT-ND
R33 = R0603-75-1%: Chip Resistor; Supplier 1: Digi-Key; Supplier Part Number 1: P75.0HCT-ND
R34 = R0603-100-1%: Chip Resistor; Supplier 1: Digi-Key; Supplier Part Number 1: P100HCT-ND
R35 = R0603-110K-1%: Chip Resistor
R36 = R0603-41.2K-1%: Chip Resistor; Supplier 1: Digi-Key; Supplier Part Number 1: P41.2KHCT-ND
U2 = TMC2209-LA: Ultra-silent motor driver IC for two phase stepper motors.; SourceLibrary: Add_to_database_2020-10-29; Built_By: EMA_Cory; Vendor: Trinamic; Datasheet: https://www.trinamic.com/products/integrated-circuits/details/tmc2209-la/; Copyright: Copyright (C) 2018 Accelerated Designs. All rights reserved; Manufacturer_Part_Number: TMC2209-LA; RefDes: RefDes; Type: DEV
VD2 = KAA-3528ESGC: High red, super green; Red/green peak wave length: 627 nm/ 565 nm; Red/green peak current: 160 mA/ 140 mA; Red/green nominal current: 30 mA/ 25 mA; Red/green nominal voltage: 2,0 V/ 2,2 V; Red/green max voltage: 2,5 V; HelpUrl: \\Storage\Volume_2\SPEKTR-AT\Catalogs\Kingbright\KAA-3528ESGC.pdf
XTAL1 = ABM3-8.000MHZ-D2Y-T: Quartz; Supplier Part Number 1: 535-10630-2-ND; Supplier 1: Digi-Key; HelpUrl: https://abracon.com/Resonators/abm3.pdf

## Sheet LAN.SchDoc
size A4
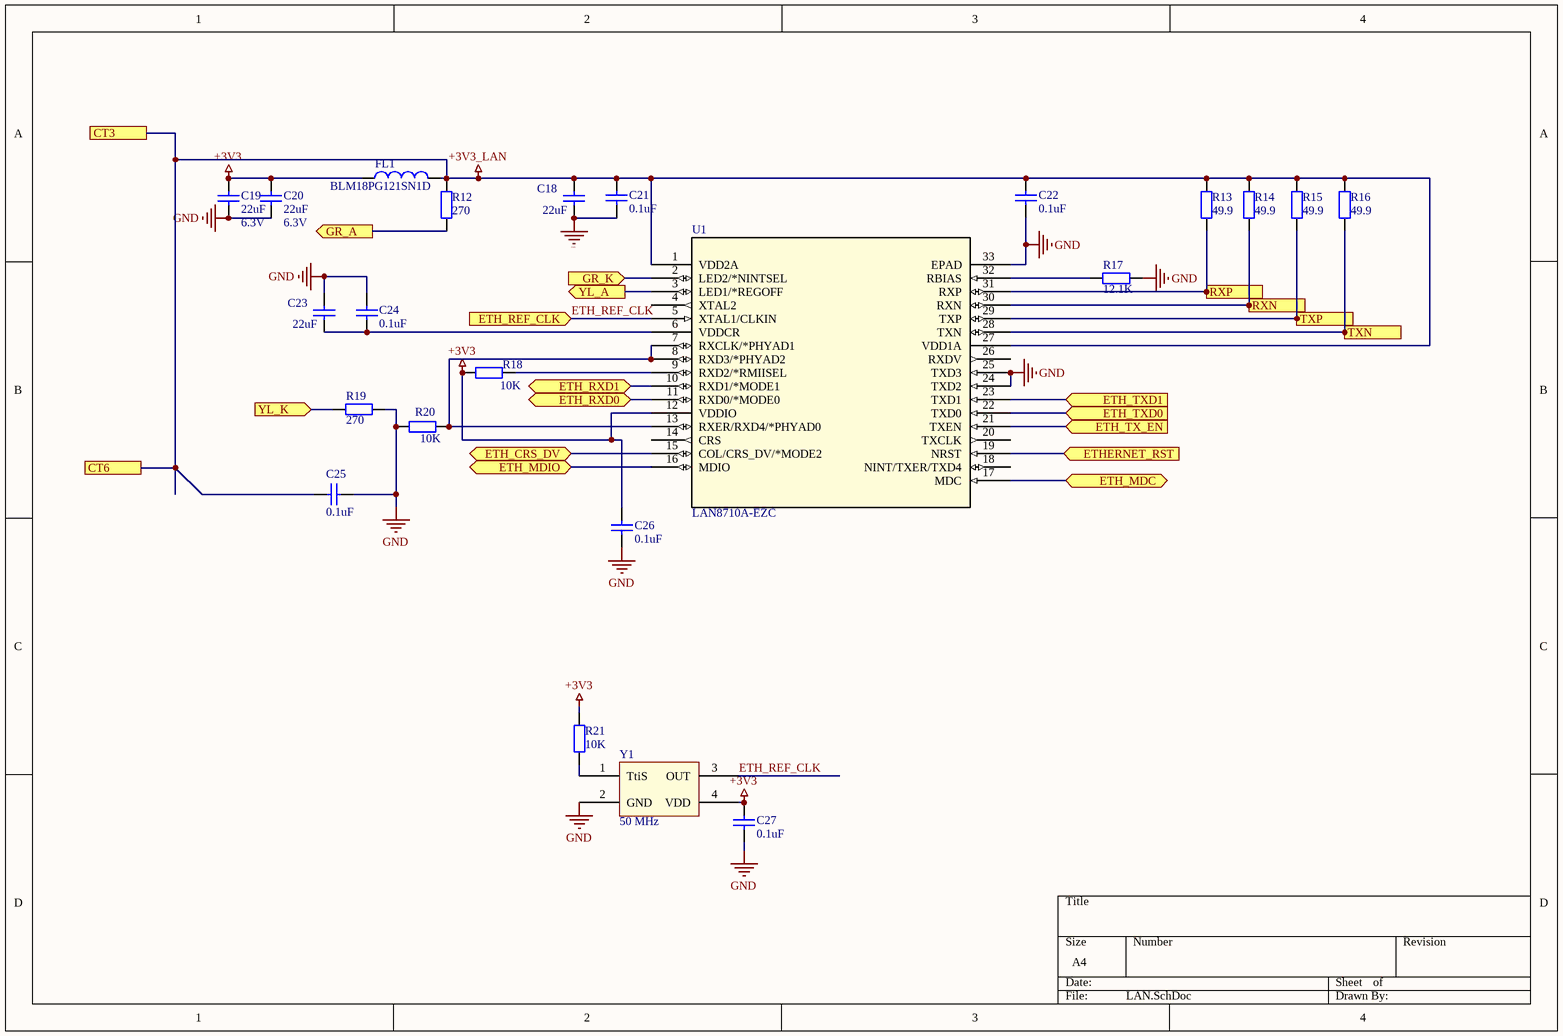
[diagram p4: LAN.SchDoc]

### Parts
C18  value 22uF  [C0805]  (hidden comment: C0805-22uF-10V-X5R)
C19  value 22uF  Voltage: 6.3V  [C0603]  (hidden comment: C0603-22uF-6.3V-X5R)
C20  value 22uF  Voltage: 6.3V  [C0603]  (hidden comment: C0603-22uF-6.3V-X5R)
C21  value 0.1uF  [C0603]  (hidden comment: C0603-0.1uF-50V-X7R)
C22  value 0.1uF  [C0603]  (hidden comment: C0603-0.1uF-50V-X7R)
C23  value 22uF  [C0805]  (hidden comment: C0805-22uF-10V-X5R)
C24  value 0.1uF  [C0603]  (hidden comment: C0603-0.1uF-50V-X7R)
C25  value 0.1uF  [C0603]  (hidden comment: C0603-0.1uF-50V-X7R)
C26  value 0.1uF  [C0603]  (hidden comment: C0603-0.1uF-50V-X7R)
C27  value 0.1uF  [C0603]  (hidden comment: C0603-0.1uF-50V-X7R)
FL1  BLM18PG121SN1D  [BLM18AG102BH1D]
R12  value 270  [R0603]  (hidden comment: R0603-270-1%)
R13  value 49.9  [R0603]  (hidden comment: R0603-49.9-1%)
R14  value 49.9  [R0603]  (hidden comment: R0603-49.9-1%)
R15  value 49.9  [R0603]  (hidden comment: R0603-49.9-1%)
R16  value 49.9  [R0603]  (hidden comment: R0603-49.9-1%)
R17  value 12.1K  [R0603]  (hidden comment: R0603-12.1K-1%)
R18  value 10K  [R0603]  (hidden comment: R0603-10K-1%)
R19  value 270  [R0603]  (hidden comment: R0603-270-1%)
R20  value 10K  [R0603]  (hidden comment: R0603-10K-1%)
R21  value 10K  [R0603]  (hidden comment: R0603-10K-1%)
U1  LAN8710A-EZC  [QFN32_5X5MC_MCH]
Y1  value 50 MHz  [D7SX]  (hidden comment: HXO-36B 50.000 HZ)

### Ports
CT3, CT6, ETH_CRS_DV (bidir), ETH_MDC (bidir), ETH_MDIO (bidir), ETH_REF_CLK (in), ETH_RXD0 (bidir), ETH_RXD1 (bidir), ETH_TX_EN (in), ETH_TXD0 (in), ETH_TXD1 (in), ETHERNET_RST (in), GR_A (out), GR_K (in), RXN (out), RXP (out), TXN (out), TXP (out), YL_A (out), YL_K (in)

### Nets
+3V3: C19.2 C20.2 C26.2 C27.2 FL1.1 R18.1 R21.2 U1.12(VDDIO) Y1.4(VDD)
+3V3_LAN: C18.2 C21.1 C22.1 C25.2 FL1.2 R12.2 R13.2 R14.2 R15.2 R16.2 U1.1(VDD2A) U1.27(VDD1A) ; port CT6, port CT3
GND: C18.1 C19.1 C20.1 C21.2 C22.2 C23.2 C24.2 C25.1 C26.1 C27.1 R17.2 R19.1 R20.1 U1.24(TXD2) U1.25(TXD3) U1.33(EPAD) Y1.2(GND)
ETH_CRS_DV: U1.15(COL/CRS_DV/*MODE2) ; port ETH_CRS_DV
ETH_MDC: U1.17(MDC) ; port ETH_MDC
ETH_MDIO: U1.16(MDIO) ; port ETH_MDIO
ETH_REF_CLK: U1.5(XTAL1/CLKIN) Y1.3(OUT) ; port ETH_REF_CLK
ETH_RXD0: U1.11(RXD0/*MODE0) ; port ETH_RXD0
ETH_RXD1: U1.10(RXD1/*MODE1) ; port ETH_RXD1
ETH_TX_EN: U1.21(TXEN) ; port ETH_TX_EN
ETH_TXD0: U1.22(TXD0) ; port ETH_TXD0
ETH_TXD1: U1.23(TXD1) ; port ETH_TXD1
ETHERNET_RST: U1.19(NRST) ; port ETHERNET_RST
GR_A: R12.1 ; port GR_A
GR_K: U1.2(LED2/*NINTSEL) ; port GR_K
RX_N: R14.1 U1.30(RXN) ; port RXN
RX_P: R13.1 U1.31(RXP) ; port RXP
TX_N: R16.1 U1.28(TXN) ; port TXN
TX_P: R15.1 U1.29(TXP) ; port TXP
YL_A: U1.3(LED1/*REGOFF) ; port YL_A
YL_K: R19.2 ; port YL_K
NetC23_1: C23.1 C24.1 U1.6(VDDCR)
NetR17_1: R17.1 U1.32(RBIAS)
NetR18_2: R18.2 U1.9(RXD2/*RMIISEL)
NetR20_2: R20.2 U1.7(RXCLK/*PHYAD1) U1.8(RXD3/*PHYAD2) U1.13(RXER/RXD4/*PHYAD0)
NetR21_1: R21.1 Y1.1(TtiS)

Not connected (* = marked no-connect by the designer): U1 4(XTAL2) 14(CRS) 18(NINT/TXER/TXD4) 20(TXCLK) 26(RXDV)

### Library data of the parts
C18 C23 = C0805-22uF-10V-X5R: Ceramic Capacitor; Supplier 1: Digi-Key; Supplier Part Number 1: 490-10511-1-ND
C19 C20 = C0603-22uF-6.3V-X5R: Ceramic Capacitor; Supplier 1: Digi-Key; Supplier Part Number 1: 445-8028-1-ND
C21 C22 C24-C27 = C0603-0.1uF-50V-X7R: Ceramic Capacitor; Supplier 1: Digi-Key; Supplier Part Number 1: 445-1324-1-ND
FL1 = BLM18PG121SN1D: Filter; Manufacturer_Name: Murata Electronics; Datasheet Link: https://www.murata.com/en-us/products/productdetail?partno=BLM18PG121SN1%23; Height: 0.95mm; Manufacturer_Part_Number: BLM18PG121SN1D; Arrow Part Number: BLM18PG121SN1D; Arrow Price/Stock: https://www.arrow.com/en/products/blm18pg121sn1d/murata-manufacturing; Mouser Part Number: 81-BLM18PG121SN1D; Mouser Price/Stock: https://www.mouser.co.uk/ProductDetail/Murata-Electronics/BLM18PG121SN1D?qs=tY8e8KZalarVxhnmnUYZ1A%3D%3D
R12 R19 = R0603-270-1%: Chip Resistor; Supplier 1: Digi-Key; Supplier Part Number 1: P300HCT-ND
R13-R16 = R0603-49.9-1%: Chip Resistor; Supplier 1: Digi-Key; Supplier Part Number 1: P49.9HTR-ND
R17 = R0603-12.1K-1%: Chip Resistor; Supplier 1: Digi-Key; Supplier Part Number 1: P12.1KHTR-ND
R18 R20 R21 = R0603-10K-1%: Chip Resistor; Supplier 1: Digi-Key; Supplier Part Number 1: P10.0KHCT-ND
U1 = LAN8710A-EZC: Small Footprint MII/RMII 10/100 Ethernet / Transceiver with HP Auto-MDIX and / flexPWR® Technology; Vendor: Microchip; Built_By: EMA_UL_Team; SourceLibrary: Microchip_2014-12-15; Manufacturer_Part_Number: LAN8710A-EZC; Copyright: Copyright (C) 2018 Accelerated Designs. All rights reserved; RefDes: RefDes; Type: DEV

## Nets that join several sheets
+3V3: Panorama_V_0_0_1 (X11.1), POWER (C8.2 D3.1 L2.2 R5.2), MCU (29 pins), LAN (9 pins)
+3V3_LAN: Panorama_V_0_0_1 (X1.3 X1.6), LAN (12 pins)
+5V: Panorama_V_0_0_1 (X2.1 X8.3), POWER (5 pins)
+12V: Panorama_V_0_0_1 (C1.2 X4.1 X4.2 X7.1), POWER (12 pins), MCU (7 pins)
+V_EXT: Panorama_V_0_0_1 (X3.1), POWER (C11.1 C12.1 DA4.3)
GND: Panorama_V_0_0_1 (13 pins), POWER (21 pins), MCU (38 pins), LAN (17 pins)
GND_EXT: Panorama_V_0_0_1 (X3.2), POWER (C11.2 C12.2 DA4.2)
+PWR_LASER: Panorama_V_0_0_1 (X8.1), POWER (C5.2 L1.2 R2.2)
BASLER_INPUT_LINE: Panorama_V_0_0_1 (X6.1), MCU (DD1.81)
EN_LED: Panorama_V_0_0_1 (X9.2), MCU (DD1.40)
ETH_CRS_DV: MCU (DD1.32), LAN (U1.15)
ETH_MDC: MCU (DD1.16), LAN (U1.17)
ETH_MDIO: MCU (DD1.25), LAN (U1.16)
ETH_REF_CLK: MCU (DD1.24), LAN (U1.5 Y1.3)
ETH_RXD0: MCU (DD1.33), LAN (U1.11)
ETH_RXD1: MCU (DD1.34), LAN (U1.10)
ETH_TX_EN: MCU (DD1.48), LAN (U1.21)
ETH_TXD0: MCU (DD1.51), LAN (U1.22)
ETH_TXD1: MCU (DD1.52), LAN (U1.23)
ETHERNET_RST: MCU (DD1.35), LAN (U1.19)
GR_A: Panorama_V_0_0_1 (X1.9), LAN (R12.1)
GR_K: Panorama_V_0_0_1 (X1.10), LAN (U1.2)
LASER_CURRENT: Panorama_V_0_0_1 (X9.1), MCU (DD1.26)
LASER_ENABLE: POWER (VT1.1), MCU (DD1.1)
MOTOR_A1: Panorama_V_0_0_1 (X5.2), MCU (U2.24)
MOTOR_A2: Panorama_V_0_0_1 (X5.1), MCU (U2.21)
MOTOR_B1: Panorama_V_0_0_1 (X5.3), MCU (U2.26)
MOTOR_B2: Panorama_V_0_0_1 (X5.4), MCU (U2.1)
NERROR: Panorama_V_0_0_1 (X9.3), MCU (DD1.39)
NRST: Panorama_V_0_0_1 (X11.3), MCU (DD1.14)
Photo_Transistor_Out: Panorama_V_0_0_1 (X7.2), MCU (R35.2)
RX_N: Panorama_V_0_0_1 (X1.8), LAN (R14.1 U1.30)
RX_P: Panorama_V_0_0_1 (X1.7), LAN (R13.1 U1.31)
RXD: Panorama_V_0_0_1 (X10.2), MCU (DD1.79 R31.2)
SWCLK: Panorama_V_0_0_1 (X11.4), MCU (DD1.76)
SWDIO: Panorama_V_0_0_1 (X11.5), MCU (DD1.72)
TRACE_SWO: Panorama_V_0_0_1 (X11.6), MCU (DD1.89)
TX_N: Panorama_V_0_0_1 (X1.2), LAN (R16.1 U1.28)
TX_P: Panorama_V_0_0_1 (X1.1), LAN (R15.1 U1.29)
TXD: Panorama_V_0_0_1 (X10.1), MCU (DD1.78 R32.2)
YL_A: Panorama_V_0_0_1 (X1.11), LAN (U1.3)
YL_K: Panorama_V_0_0_1 (X1.12), LAN (R19.2)